# Altium schematic sheet Sensors_IO_Board.SchDoc: Sensors IO Board
size A4; DrawnBy: Samyar Sadat Akhavi; Revision: 1.0; SheetNumber: 1; SheetTotal: 13
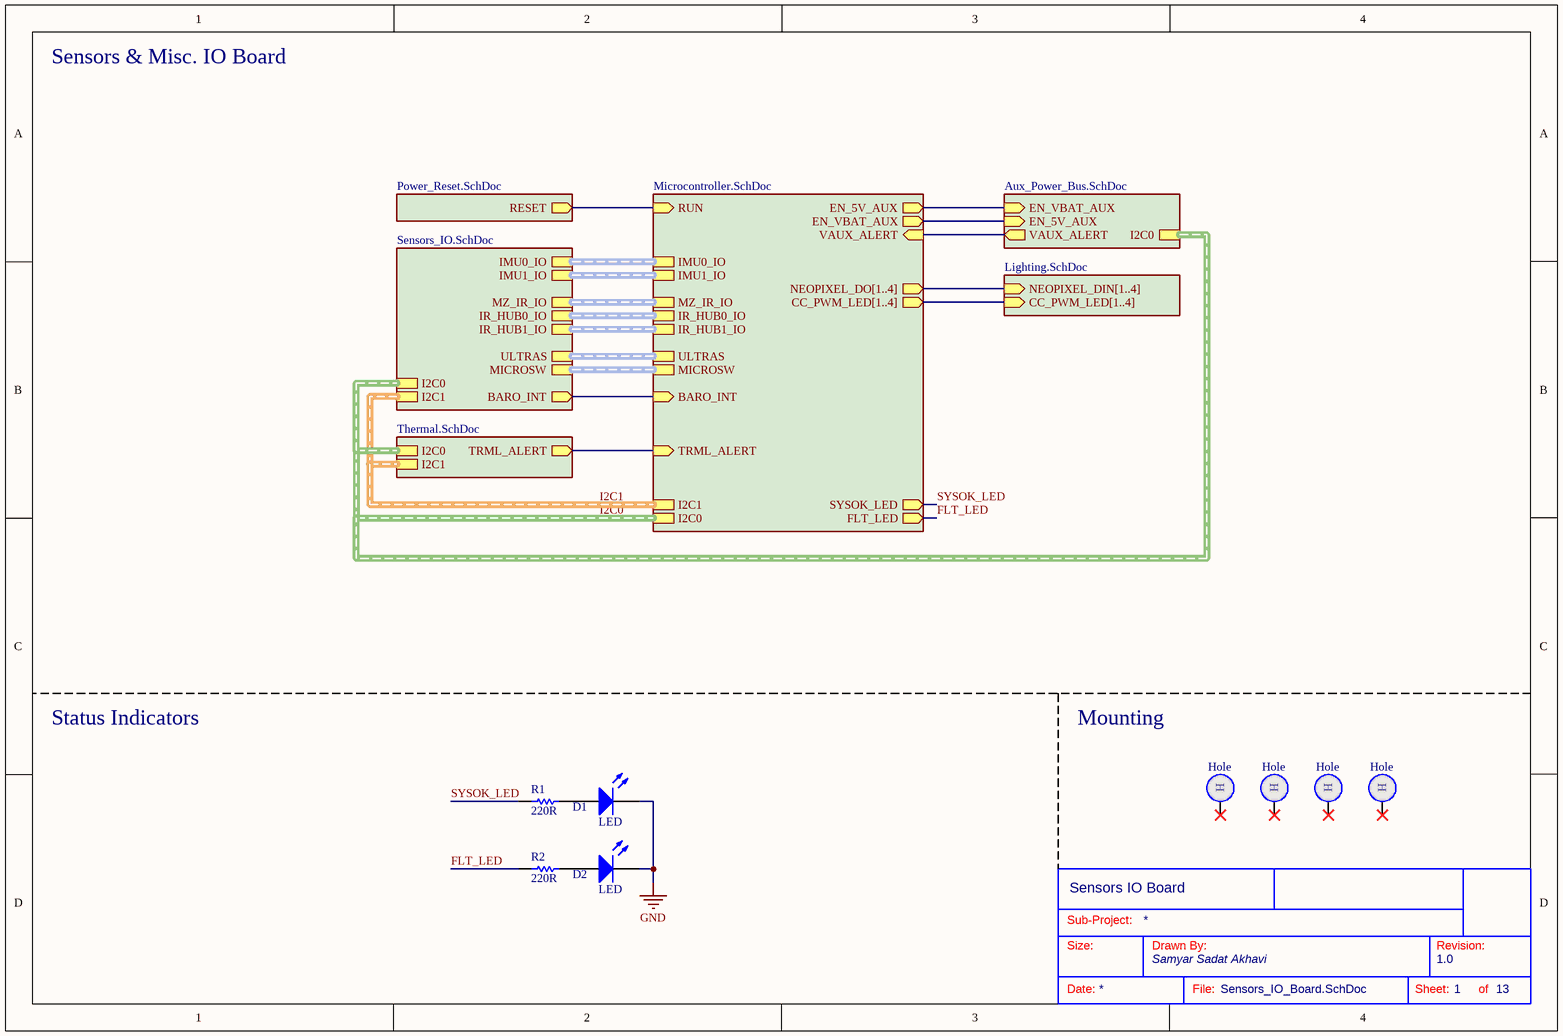
[diagram p0: Sensors_IO_Board.SchDoc]

## Parts
?  (no value)  (graphical)
D1  LED  [LED_1206]
D2  LED  [LED_1206]
Hole1  Hole  [hole_2.6]  (no BOM)
Hole2  Hole  [hole_2.6]  (no BOM)
Hole3  Hole  [hole_2.6]  (no BOM)
Hole4  Hole  [hole_2.6]  (no BOM)
R1  220R  [RES_0603]
R2  220R  [RES_0603]

## Sub-sheets
AUX_PWR = Aux_Power_Bus.SchDoc: I2C0 (harness I2C), EN_5V_AUX (in), VAUX_ALERT (out), EN_VBAT_AUX (in)
LIGHTING = Lighting.SchDoc: NEOPIXEL_DIN[1..4] (in), CC_PWM_LED[1..4] (in)
MCU = Microcontroller.SchDoc: RUN (in), I2C1 (harness I2C), I2C0 (harness I2C), EN_5V_AUX (out), EN_VBAT_AUX (out), VAUX_ALERT (in), BARO_INT (in), IR_HUB0_IO (harness ToF_Hub_IO), IR_HUB1_IO (harness ToF_Hub_IO), IMU0_IO (harness IMU_IO), IMU1_IO (harness IMU_IO), MICROSW (harness Microswitches), MZ_IR_IO (harness ToF_IO), ULTRAS (harness Ultrasonics), TRML_ALERT (in), NEOPIXEL_DO[1..4] (out), CC_PWM_LED[1..4] (out), FLT_LED (out), SYSOK_LED (out)
PWR = Power_Reset.SchDoc: RESET (out)
SENS_IO = Sensors_IO.SchDoc: BARO_INT (out), I2C0 (harness I2C), I2C1 (harness I2C), IMU0_IO (harness IMU_IO), IMU1_IO (harness IMU_IO), IR_HUB0_IO (harness ToF_Hub_IO), IR_HUB1_IO (harness ToF_Hub_IO), MICROSW (harness Microswitches), MZ_IR_IO (harness ToF_IO), ULTRAS (harness Ultrasonics)
THERM_CTRL = Thermal.SchDoc: I2C0 (harness I2C), I2C1 (harness I2C), TRML_ALERT (out)

## Nets
GND: D1.2(K) D2.2(K)
FLT_LED: R2.2 ; sheet MCU/FLT_LED
SYSOK_LED: R1.2 ; sheet MCU/SYSOK_LED
NetD1_1: D1.1(A) R1.1
NetD2_1: D2.1(A) R2.1
(unnamed): sheet MCU/RUN, sheet PWR/RESET
(unnamed): sheet MCU/EN_5V_AUX, sheet AUX_PWR/EN_VBAT_AUX
(unnamed): sheet MCU/EN_VBAT_AUX, sheet AUX_PWR/EN_5V_AUX
(unnamed): sheet MCU/VAUX_ALERT, sheet AUX_PWR/VAUX_ALERT
(unnamed): sheet MCU/BARO_INT, sheet SENS_IO/BARO_INT
(unnamed): sheet MCU/TRML_ALERT, sheet THERM_CTRL/TRML_ALERT

Not connected (* = marked no-connect by the designer): Hole1 1*; Hole2 1*; Hole3 1*; Hole4 1*

## Buses and harness runs
bus sheet LIGHTING/CC_PWM_LED[1..4] = sheet MCU/CC_PWM_LED[1..4]
bus sheet LIGHTING/NEOPIXEL_DIN[1..4] = sheet MCU/NEOPIXEL_DO[1..4]
harness I2C0 = sheet AUX_PWR/I2C0 = sheet MCU/I2C0 = sheet SENS_IO/I2C0 = sheet THERM_CTRL/I2C0
harness I2C1 = sheet MCU/I2C1 = sheet SENS_IO/I2C1 = sheet THERM_CTRL/I2C1
harness sheet MCU/IMU0_IO = sheet SENS_IO/IMU0_IO
harness sheet MCU/IMU1_IO = sheet SENS_IO/IMU1_IO
harness sheet MCU/IR_HUB0_IO = sheet SENS_IO/IR_HUB0_IO
harness sheet MCU/IR_HUB1_IO = sheet SENS_IO/IR_HUB1_IO
harness sheet MCU/MICROSW = sheet SENS_IO/MICROSW
harness sheet MCU/MZ_IR_IO = sheet SENS_IO/MZ_IR_IO
harness sheet MCU/ULTRAS = sheet SENS_IO/ULTRAS

## Notes on the sheet
- Sensors & Misc. IO Board
- Status Indicators
- Mounting
- Sub-Project:
- Size:
- Drawn By:
- Revision:
- Date:
- File:
- Sheet:
- of
- (in symbol Hole) H

## Library data of the parts
? = Standard Title Block
D1 = LED: Indicator LED; Color: Green
D2 = LED: Indicator LED; Color: Amber
R1 R2 = Resistor: Power: 1/8W; Value: 220R